# Altium project PCB_CT.PrjPcb
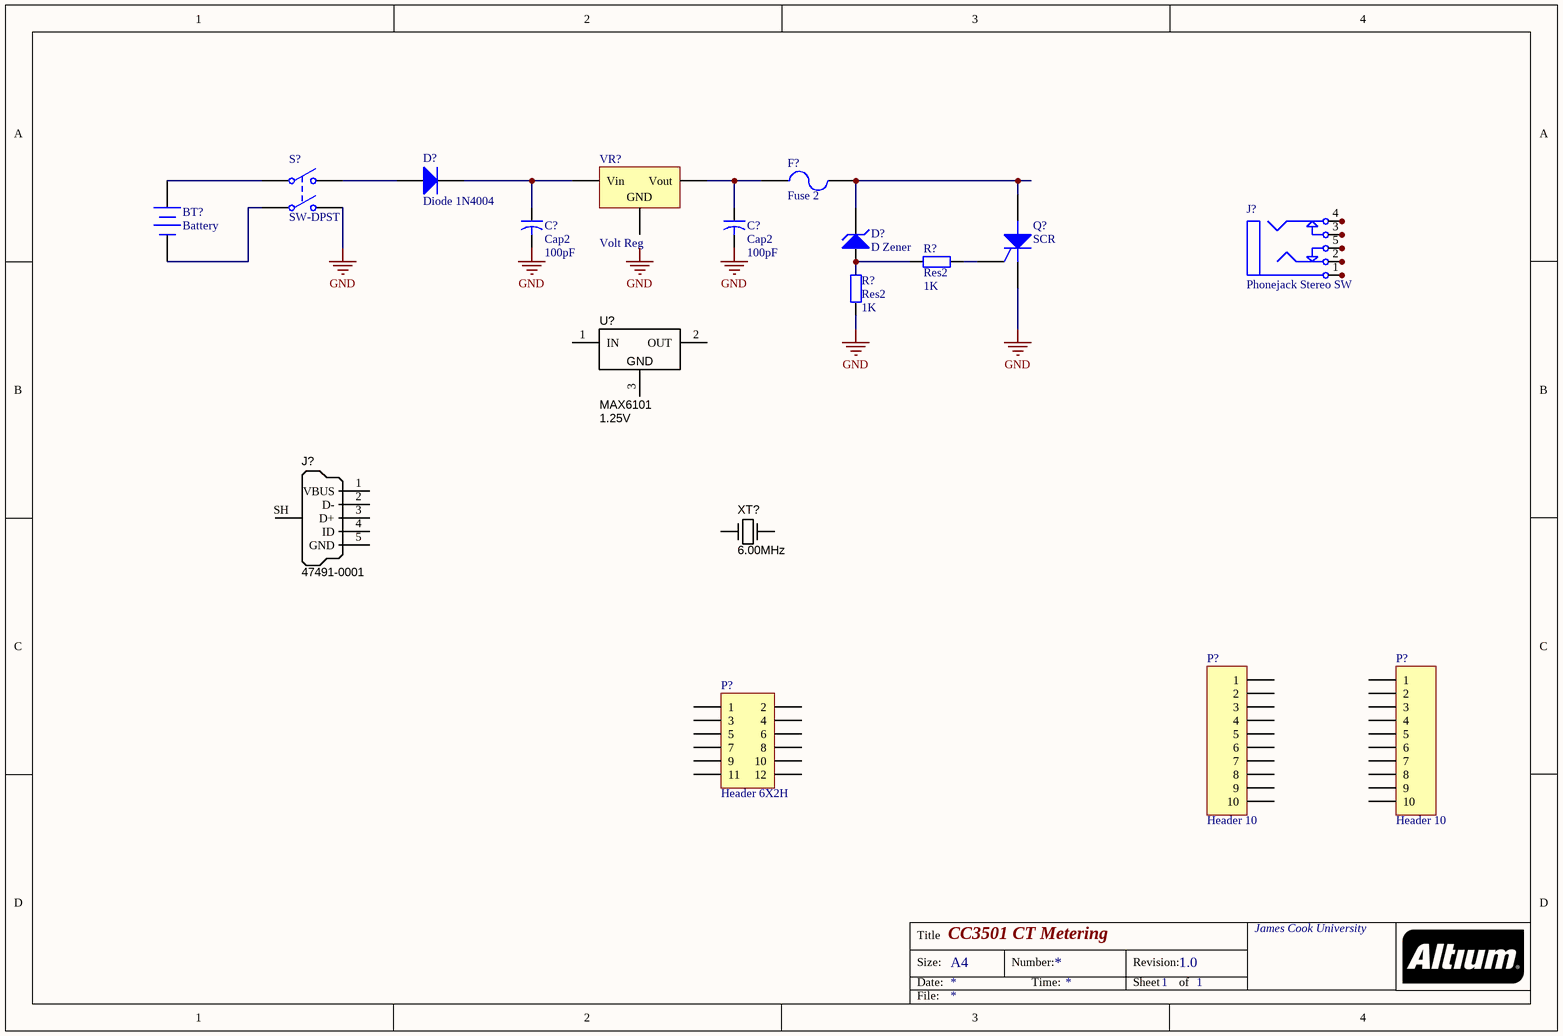
[diagram p0: CT Metering Assingment.SchDoc]
1 sheet, 18 parts. Net scope: global (net labels, ports and power ports of the same name join across sheets).

## Sheet CT Metering Assingment.SchDoc: CC3501 CT Metering
size A4; DrawnBy: Clinton Elliott & Micko; Organization: James Cook University; Revision: 1.0; SheetNumber: 1; SheetTotal: 1

### Parts
(Parts that share a designator on the sheet are numbered #1, #2 ... from top to bottom, then left to right.)
BT?  Battery  [BAT-2]
C?#1  Cap2  value 100pF  [CAPR5-4X5]
C?#2  Cap2  value 100pF  [CAPR5-4X5]
D?#1  Diode 1N4004  [DO-41]
D?#2  D Zener  [DIODE-0.7]
F?  Fuse 2  [PIN-W2/E2.8]
J?#1  Phonejack Stereo SW  [ST-3150-5N]
J?#2  Manufacturer Part Number 1: 47491-0001  [USB_Micro-B_Molex_SMD]  (hidden comment: USB Micro Type B)
P?#1  Header 10  [HDR1X10]
P?#2  Header 10  [HDR1X10]
P?#3  Header 6X2H  [HDR2X6H]
Q?  SCR  [TO-220-AB]
R?#1  Res2  value 1K  [AXIAL-0.4]
R?#2  Res2  value 1K  [AXIAL-0.4]
S?  SW-DPST  [DPST-4]
U?  MAX6101  value 1.25V  [SOT23-3]
VR?  Volt Reg  [D2PAK_N]
XT?  6.00MHz  [CRYSTAL_CMR309T]

### Nets
GND: C?#1.2 C?#2.2 Q?.3(K) R?#2.1 S?.4(NO2)
NetBT?_1: BT?.1(+) S?.1(COMMON1)
NetBT?_2: BT?.2(-) S?.3(COMMON2)
NetC?#1_1: C?#1.1 D?#1.2(K) VR?.1(Vin)
NetC?#2_1: C?#2.1 F?.1 VR?.3(Vout)
NetD?#1_1: D?#1.1(A) S?.2(NO1)
NetD?#2_1: D?#2.1(A) R?#1.2 R?#2.2
NetD?#2_2: D?#2.2(K) F?.2 Q?.1(A)
NetJ?#1_1: J?#1.1 J?#1.1A J?#1.1B
NetJ?#1_2: J?#1.2 J?#1.2A J?#1.2B
NetJ?#1_3: J?#1.3 J?#1.3A J?#1.3B
NetJ?#1_4: J?#1.4 J?#1.4A J?#1.4B
NetJ?#1_5: J?#1.5 J?#1.5A J?#1.5B
NetQ?_2: Q?.2(G) R?#1.1

Not connected (* = marked no-connect by the designer): J?#2 1(VBUS) 2(D-) 3(D+) 4(ID) 5(GND) SH(Shell); P?#1 1 2 3 4 5 6 7 8 9 10; P?#2 1 2 3 4 5 6 7 8 9 10; P?#3 1 2 3 4 5 6 7 8 9 10 11 12; U? 1(IN) 2(OUT) 3(GND); VR? 2(GND); XT? 1(IN) 2(OUT)

### Notes on the sheet
- Labels drawn without touching a wire or pin: GND
- Title
- Size:
- Date:
- A4
- Number:
- Time:
- Revision:
- Sheet
- of
- File:

### Library data of the parts
BT? = Battery: Multicell Battery; Published: 24-Mar-1999; LatestRevisionDate: 17-Jul-2002; LatestRevisionNote: Re-released for DXP Platform.; PackageReference: BAT-2; Publisher: Altium Limited; PackageDescription: Battery; 2 Leads
C?#1 C?#2 = Cap2: Capacitor; Published: 23-Sep-2002; PackageReference: CAPR5-4X5; Publisher: Altium Limited; PackageDescription: Capacitor; 2 Leads
D?#1 = Diode 1N4004: 1 Amp General Purpose Rectifier; Published: 8-Jun-2000; LatestRevisionDate: 17-Jul-2002; LatestRevisionNote: Re-released for DXP Platform.; DatasheetVersion: 1998; PackageVersion: Aug-1999; PackageReference: DO-41; Publisher: Altium Limited; PackageDescription: Diode, Axial; Body 5.2 x 2.7 mm (LxDia. max), Lead Dia. 0.86 mm (max); Code_JEDEC: DO-204-AL; ComponentLink1Description: Manufacturer Link; ComponentLink1URL: http://www.fairchildsemi.com/; ComponentLink2Description: Datasheet; ComponentLink2URL: http://www.fairchildsemi.com/ds/1N%2F1N4001.pdf
D?#2 = D Zener: Zener Diode; Published: 8-Jun-2000; LatestRevisionDate: 17-Jul-2002; LatestRevisionNote: Re-released for DXP Platform.; PackageReference: DIODE-0.7; Publisher: Altium Limited; PackageDescription: Diode, Thru-Hole; 2 Leads; 0.7 in Pin Spacing
F? = Fuse 2: Fuse; Published: 8-Jun-2000; LatestRevisionDate: 17-Jul-2002; LatestRevisionNote: Re-released for DXP Platform.; PackageReference: PIN-W2/E2.8; Publisher: Altium Limited; PackageDescription: Thru-Hole; 2 Leads
J?#1 = Phonejack Stereo SW: 3-Conductor Jack with 2 break contacts (normals) and 2 auxiliary make contacts; Published: 5-Jan-2004; LatestRevisionDate: 17-Dec-2003; LatestRevisionNote: PCB Footprint replaced.; DatasheetDocument: 07-Mar-2000; Publisher: Altium Limited; ComponentLink1Description: Manufacturer Link; ComponentLink1URL: http://domino.kycon.com/internet/Products.html
J?#2 = USB_Micro_TypeB: Connector SMD USB Micro Type B middle mount; Manufacturer 1: Molex Inc; Package / Case: SMD; Supplier 1: Digi-Key; Supplier Part Number 1: WM17142CT-ND
P?#1 P?#2 = Header 10: Header, 10-Pin; LatestRevisionDate: 17-Jul-2002; LatestRevisionNote: Re-released for DXP Platform.; Publisher: Altium Limited
P?#3 = Header 6X2H: Header, 6-Pin, Dual row, Right Angle; LatestRevisionDate: 17-Jul-2002; LatestRevisionNote: Re-released for DXP Platform.; Publisher: Altium Limited
Q? = SCR: Silicon Controlled Rectifier; Published: 8-Jun-2000; LatestRevisionDate: 17-Jul-2002; LatestRevisionNote: Re-released for DXP Platform.; PackageReference: TO-220-AB; Publisher: Altium Limited; Code_JEDEC: TO-220-AB
R?#1 R?#2 = Res2: Resistor; Published: 8-Jun-2000; LatestRevisionDate: 17-Jul-2002; LatestRevisionNote: Re-released for DXP Platform.; PackageReference: AXIAL-0.4; Publisher: Altium Limited; PackageDescription: Axial Device, Thru-Hole; 2 Leads; 0.4 in Pin Spacing
S? = SW-DPST: Double-Pole, Single-Throw Switch; Published: 24-Mar-1999; LatestRevisionDate: 17-Jul-2002; LatestRevisionNote: Re-released for DXP Platform.; PackageReference: DPST-4; Publisher: Altium Limited; PackageDescription: Switch; 4 Leads
U? = VREG_1.25V_MAX6101EUR: Voltage Regulator 1.25V SOT23-3 SMD; Manufacturer 1: Maxim Integrated Products; Manufacturer Part Number 1: MAX6101EUR+T; Voltage Regulator Type: Adjustable Positive Linear; Tolerance: ±0.04%; Ratings: 40V in-out; 500mA; Package / Case: SOT23-3; Supplier 1: Digi-Key; Supplier Part Number 1: MAX6101EUR+TCT-ND
VR? = Volt Reg: Voltage Regulator; Published: 24-Mar-1999; LatestRevisionDate: 29-May-2009; LatestRevisionNote: IPC-7351 Footprint Added.; PackageReference: D2PAK; Publisher: Altium Limited; PackageDescription: 3-Pin Transistor Outline Package 2.54 mm Pitch, 15.1 mm Lead Span
XT? = Crystal_6MHz_CMR309T: Resonator Ceramic 6.00 MHz 30ppm; Manufacturer 1: Citizen Finetech Miyota; Manufacturer Part Number 1: CMR309T-6.000MABJ-UT; Frequency: 6MHz; Frequency Stability: ±50ppm; Load Capacitance: 18pF; Operating Mode: Fundamental; Package / Case: Cylindrical Can, Radial; Ratings: 6.00 MHz; Type: MHz Crystal; Frequency Tolerance: ±30ppm; Operating Temperature: -10°C ~ 60°C; Mounting Type: Surface Mount; Size / Dimension: 0.118" Dia x 0.346" L (3.00mm x 8.80mm); ComponentLink1URL: http://www.ctscorp.com/components/Datasheets/008-0309-0.pdf; ComponentLink1Description: http://www.ctscorp.com/components/Datasheets/008-0309-0.pdf; Height: 0.122" (3.10mm); Supplier 1: Digi-Key; Supplier Part Number 1: 300-8348-1-ND; Tolerance: ±50ppm; Value: 6.00MHz